# Altium project RSD_M1_HELMET_UNIT_PCB_V2.PrjPcb
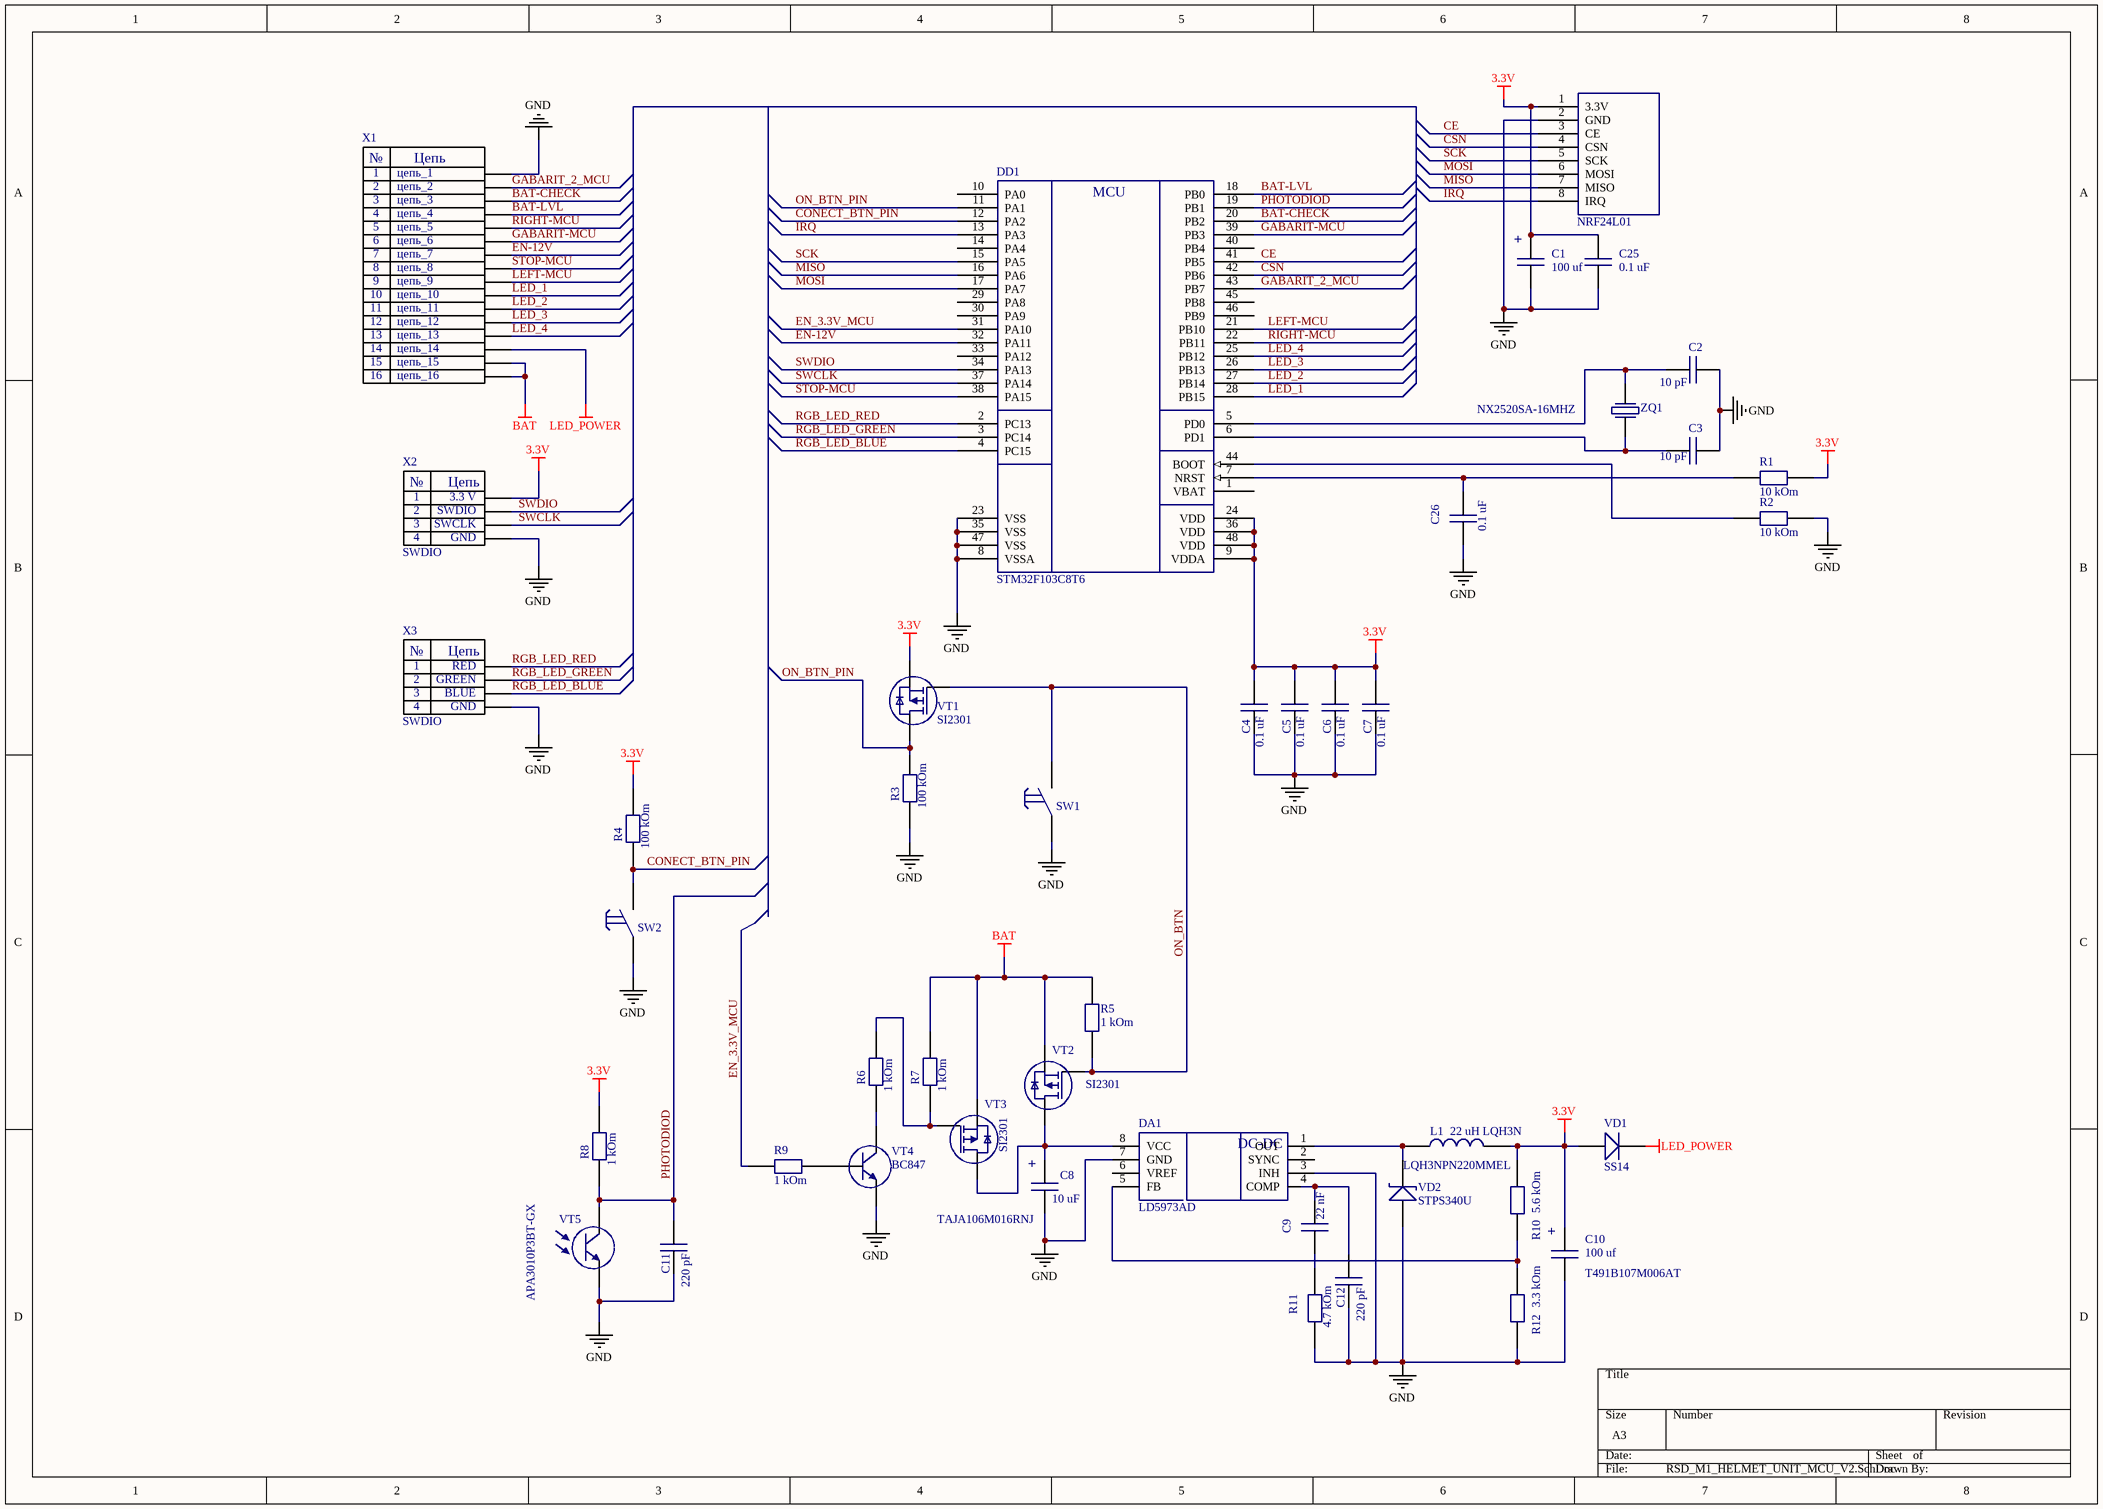
[diagram p0: RSD_M1_HELMET_UNIT_MCU_V2.SchDoc]
4 sheets, 193 parts. Net scope: flat (ports and power ports of the same name join across sheets).
Board files: RSD_M1_HELMET_UNIT_MCU_V2.PcbDoc, RSD_M1_HELMET_UNIT_POWER_V2.PcbDoc, RSD_M1_HELMET_MOTORCYCLE_UNITS_V2.PcbDoc
Sheets:
  RSD_M1_HELMET_UNIT_MCU_V2.SchDoc
  RSD_M1_HELMET_UNIT_POWER_V2.SchDoc
  RSD_M1_HELMET_UNIT_POWER_STOP_LIGHT_V2.SchDoc
  RSD_M1_HELMET_UNIT_MCU_STOP_LIGHT_V2.SchDoc

## Sheet RSD_M1_HELMET_UNIT_MCU_V2.SchDoc
size A3

### Parts
C1  100 uf  [tantal_case_B]
C2  value 10 pF  [CAP0603]  (hidden comment: Capacitor)
C3  value 10 pF  [CAP0603]  (hidden comment: Capacitor)
C4  value 0.1 uF  [CAP0603]  (hidden comment: Capacitor)
C5  value 0.1 uF  [CAP0603]  (hidden comment: Capacitor)
C6  value 0.1 uF  [CAP0603]  (hidden comment: Capacitor)
C7  value 0.1 uF  [CAP0603]  (hidden comment: Capacitor)
C8  10 uF  value TAJA106M016RNJ  [tantal_case_A]
C9  value 22 nF  [CAP0603]  (hidden comment: Capacitor)
C10  100 uf  value T491B107M006AT  [tantal_case_B]
C11  value 220 pF  [CAP0603]  (hidden comment: Capacitor)
C12  value 220 pF  [CAP0603]  (hidden comment: Capacitor)
C25  value 0.1 uF  [CAP0603]  (hidden comment: Capacitor)
C26  value 0.1 uF  [CAP0603]  (hidden comment: Capacitor)
DA1  LD5973AD  [SOIC-8]
DD1  value STM32F103C8T6  [STM32F103C8T6]  (hidden comment: STM32F103C8Tx)
L1  value 22 uH LQH3N  PN: LQH3NPN220MMEL  [LQH3N]  (hidden comment: coil)
NRF1  NRF24L01  [NRF24L01]
R1  value 10 kOm  [Res0603]  (hidden comment: Resistor)
R2  value 10 kOm  [Res0603]  (hidden comment: Resistor)
R3  value 100 kOm  [Res0603]  (hidden comment: Resistor)
R4  value 100 kOm  [Res0603]  (hidden comment: Resistor)
R5  value 1 kOm  [Res0603]  (hidden comment: Resistor)
R6  value 1 kOm  [Res0603]  (hidden comment: Resistor)
R7  value 1 kOm  [Res0603]  (hidden comment: Resistor)
R8  value 1 kOm  [Res0603]  (hidden comment: Resistor)
R9  value 1 kOm  [Res0603]  (hidden comment: Resistor)
R10  value 5.6 kOm  [Res0603]  (hidden comment: Resistor)
R11  value 4.7 kOm  [Res0603]  (hidden comment: Resistor)
R12  value 3.3 kOm  [Res0603]  (hidden comment: Resistor)
SW1  tact_switch  [tact_switch]  (value not drawn)
SW2  tact_switch  [tact_switch]  (value not drawn)
VD1  value SS14  [SMA-F]  (hidden comment: Diode)
VD2  value STPS340U  [SMB1]  (hidden comment: Schottky)
VT1  value SI2301  [SOT 23]  (hidden comment: MOSFET-P)
VT2  value SI2301  [SOT 23]  (hidden comment: MOSFET-P)
VT3  value SI2301  [SOT 23]  (hidden comment: MOSFET-P)
VT4  value BC847  [SOT 23]  (hidden comment: NPN)
VT5  value APA3010P3BT-GX  [LED0805]  (hidden comment: Phototransistor)
X1  16: цепь_16  1: цепь_1  2: цепь_2  3: цепь_3  4: цепь_4  5: цепь_5  6: цепь_6  7: цепь_7  8: цепь_8  9: цепь_9  10: цепь_10  11: цепь_11  12: цепь_12  13: цепь_13  14: цепь_14  15: цепь_15  [FPC_16_0.5]  (hidden comment: FPC_connector_16)
X2  SWDIO  1: 3.3 V  3: SWCLK  4: GND  [SWDIO]
X3  SWDIO  1: RED  2: GREEN  3: BLUE  4: GND  [SWDIO]
ZQ1  value NX2520SA-16MHZ  [crystal]  (hidden comment: Qartz)

### Nets
3.3V: C1.1 C4.2 C5.2 C6.2 C7.2 C10.1 C25.2 DD1.9(VDDA) DD1.24(VDD) DD1.36(VDD) DD1.48(VDD) L1.2 NRF1.1(3.3V) R1.2 R4.1 R8.2 R10.1 VD1.2 VT1.S X2.1
BAT: R5.2 R7.2 VT2.S VT3.S X1.15 X1.16
GND: C1.2 C2.1 C3.1 C4.1 C5.1 C6.1 C7.1 C8.2 C10.2 C11.1 C12.1 C25.1 C26.1 DA1.3(INH) DA1.7(GND) DD1.8(VSSA) DD1.23(VSS) DD1.35(VSS) DD1.47(VSS) NRF1.2(GND) R2.2 R3.2 R11.2 R12.2 SW1.1 SW2.1 VD2.2 VT4.E VT5.2 X1.1 X2.4 X3.4
LED_POWER: VD1.1 X1.14
BAT-CHECK: DD1.20(PB2) X1.3
BAT-LVL: DD1.18(PB0) X1.4
CE: DD1.41(PB5) NRF1.3(CE)
CONECT_BTN_PIN: DD1.12(PA2) R4.2 SW2.2
CSN: DD1.42(PB6) NRF1.4(CSN)
EN-12V: DD1.32(PA11) X1.7
EN_3.3V_MCU: DD1.31(PA10) R9.2
GABARIT-MCU: DD1.39(PB3) X1.6
GABARIT_2_MCU: DD1.43(PB7) X1.2
IRQ: DD1.13(PA3) NRF1.8(IRQ)
LED_1: DD1.28(PB15) X1.10
LED_2: DD1.27(PB14) X1.11
LED_3: DD1.26(PB13) X1.12
LED_4: DD1.25(PB12) X1.13
LEFT-MCU: DD1.21(PB10) X1.9
MISO: DD1.16(PA6) NRF1.7(MISO)
MOSI: DD1.17(PA7) NRF1.6(MOSI)
ON_BTN: R5.1 SW1.2 VT1.G VT2.G
ON_BTN_PIN: DD1.11(PA1) R3.1 VT1.D
PHOTODIOD: C11.2 DD1.19(PB1) R8.1 VT5.1
RGB_LED_BLUE: DD1.4(PC15) X3.3
RGB_LED_GREEN: DD1.3(PC14) X3.2
RGB_LED_RED: DD1.2(PC13) X3.1
RIGHT-MCU: DD1.22(PB11) X1.5
SCK: DD1.15(PA5) NRF1.5(SCK)
STOP-MCU: DD1.38(PA15) X1.8
SWCLK: DD1.37(PA14) X2.3
SWDIO: DD1.34(PA13) X2.2
NetC2_2: C2.2 DD1.5(PD0) ZQ1.2
NetC3_2: C3.2 DD1.6(PD1) ZQ1.1
NetC8_1: C8.1 DA1.8(VCC) VT2.D VT3.D
NetC9_1: C9.1 R11.1
NetC9_2: C9.2 C12.2 DA1.4(COMP)
NetC26_2: C26.2 DD1.7(NRST) R1.1
NetDA1_1: DA1.1(OUT) L1.1 VD2.1
NetDA1_5: DA1.5(FB) R10.2 R12.1
NetDD1_44: DD1.44(BOOT) R2.1
NetR6_1: R6.1 VT4.K
NetR6_2: R6.2 R7.1 VT3.G
NetR9_1: R9.1 VT4.B

Not connected (* = marked no-connect by the designer): DA1 2(SYNC) 6(VREF); DD1 1(VBAT) 10(PA0) 14(PA4) 29(PA8) 30(PA9) 33(PA12) 40(PB4) 45(PB8) 46(PB9)

### Notes on the sheet
- (in symbol Capacitor_Polar) +
- (in symbol FPC_connector_16) №; Цепь
- (in symbol LD5973AD) DC-DC
- (in symbol STM32F103C8Tx) MCU
- (in symbol SWDIO) №; Цепь

### Library data of the parts
C1 = Capacitor_Polar: Value: T491B107M006AT
C8 C10 = Capacitor_Polar
SW1 SW2 = tact_switch: Value: TL3330AF260QG
VT1-VT3 = MOSFET-P: pin to pad: D>3 G>1 S>2
VT4 = NPN: pin to pad: B>1 E>2 K>3
X1 = FPC_connector_16: Value: 0527461671
DA1 = LD5973AD: Value: LD5973AD
X2 X3 = SWDIO
  X2: 2: SWDIO

## Sheet RSD_M1_HELMET_UNIT_POWER_V2.SchDoc
size A2
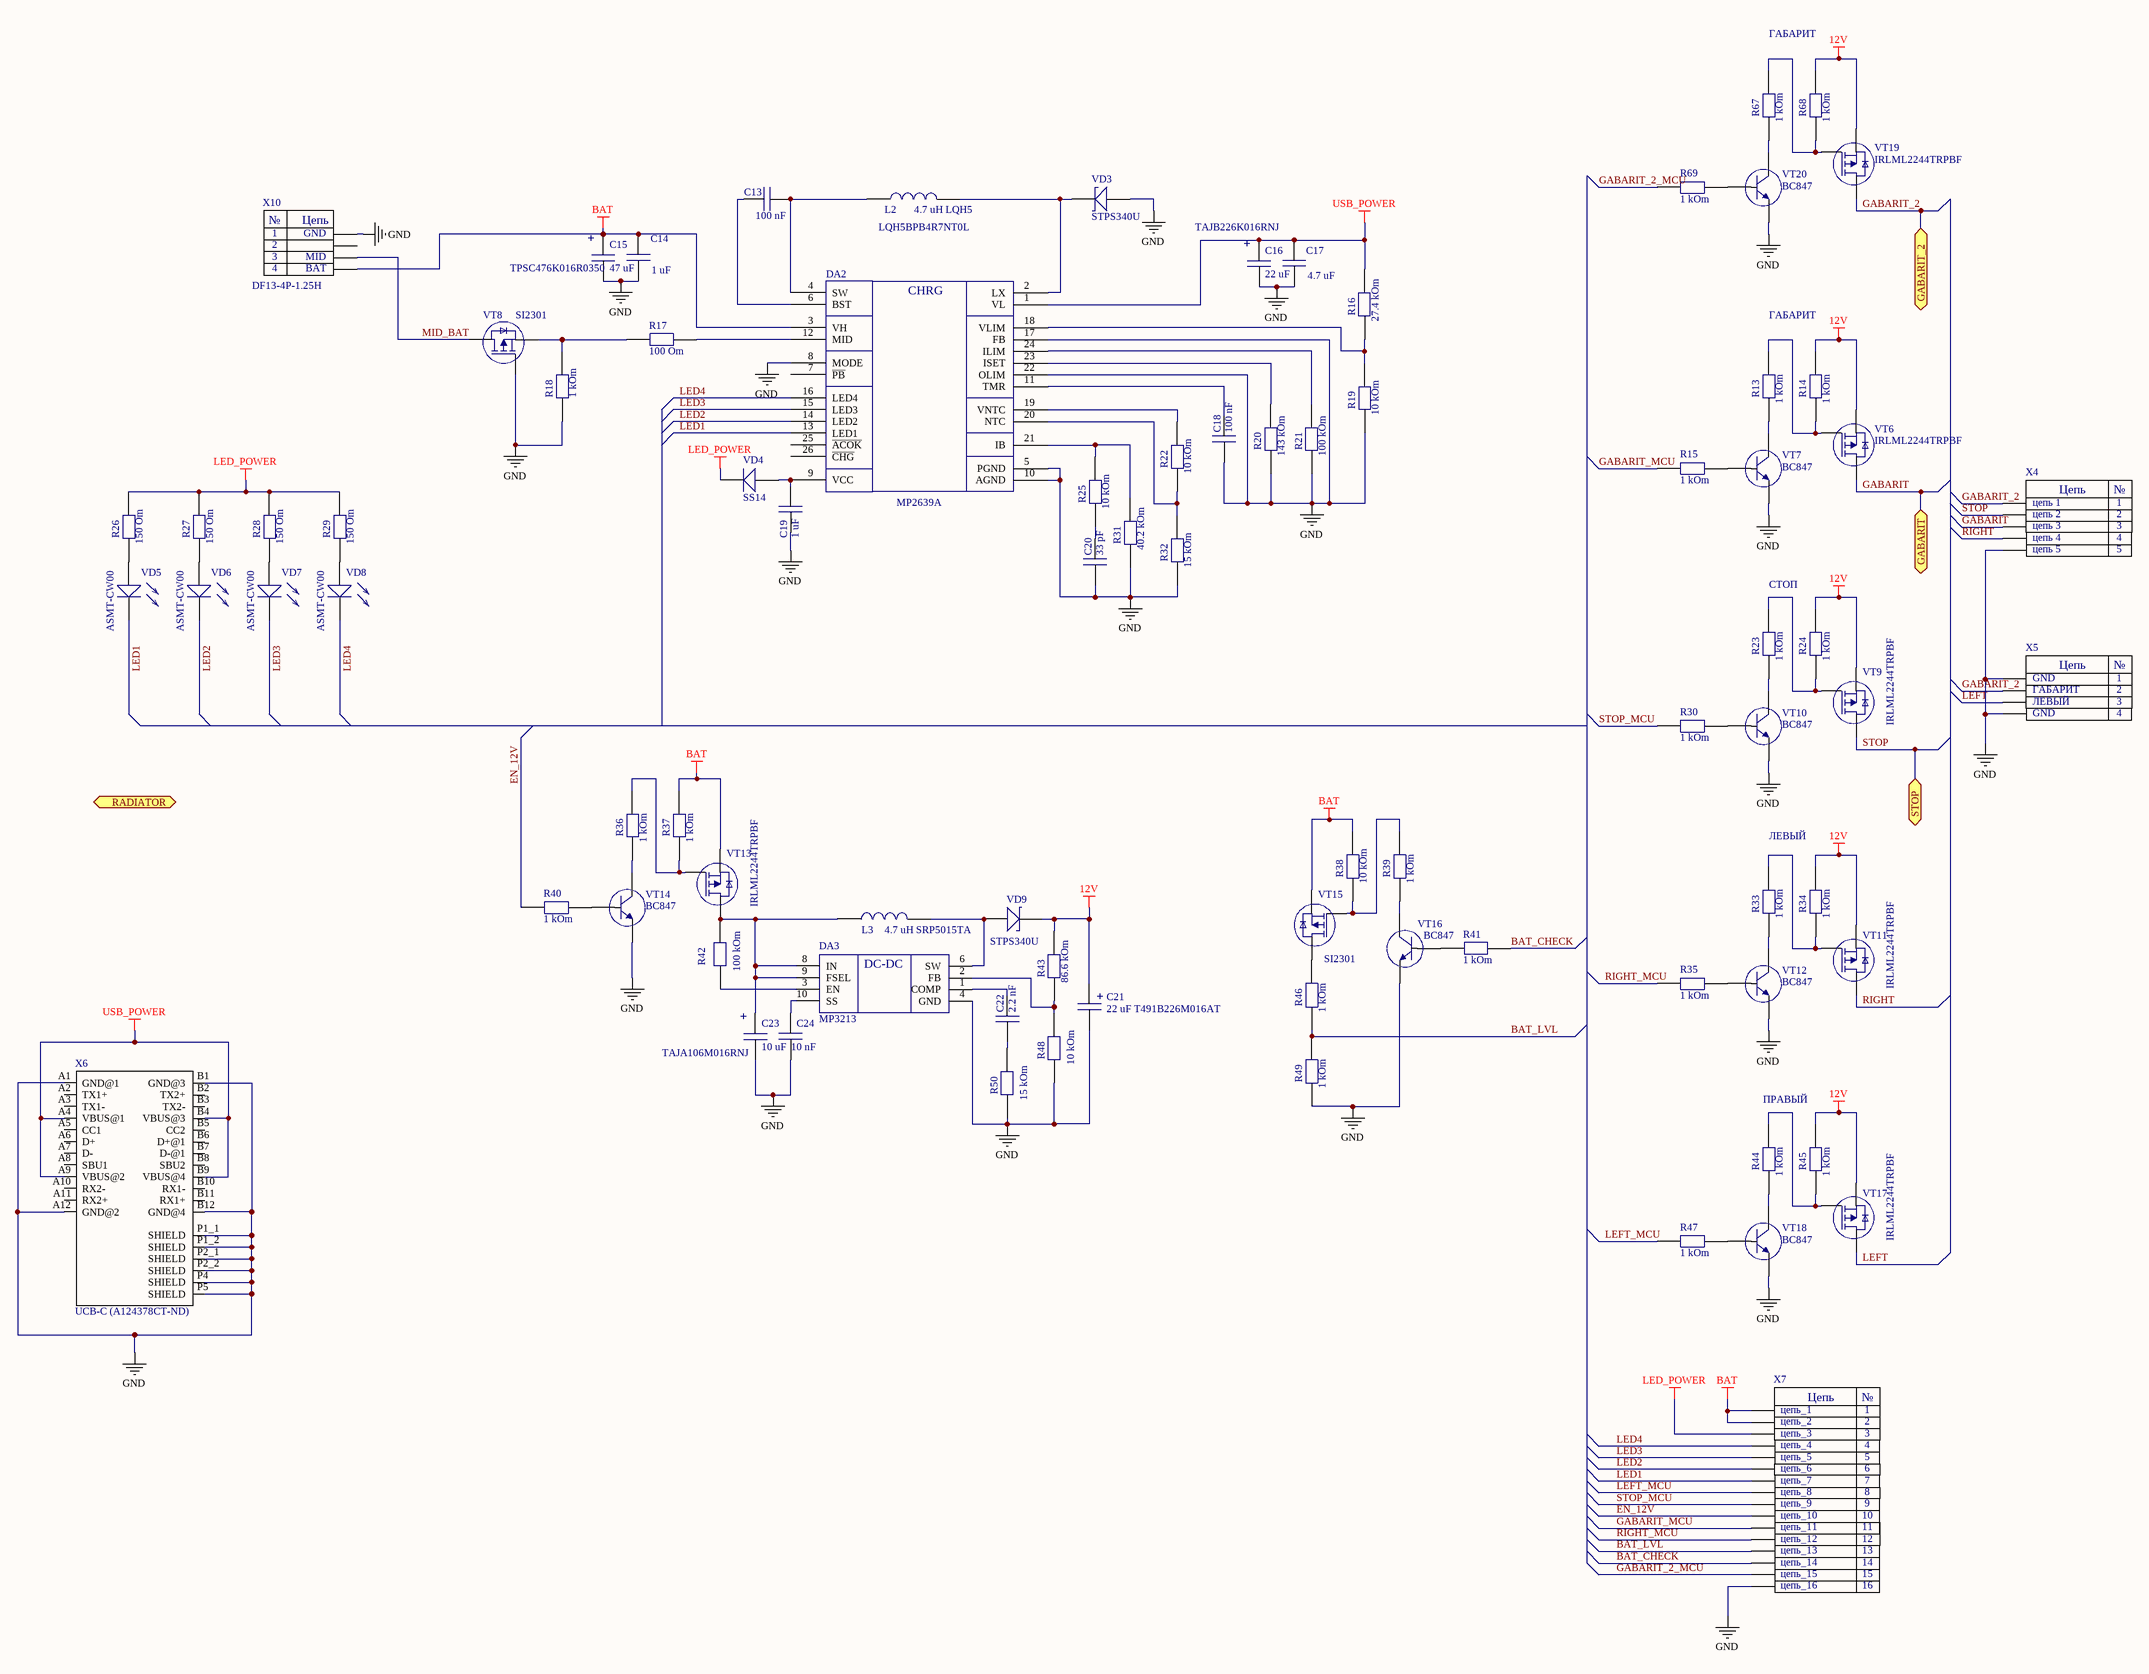
[diagram p1: RSD_M1_HELMET_UNIT_POWER_V2.SchDoc]

### Parts
C13  value 100 nF  [CAP0603]  (hidden comment: Capacitor)
C14  value 1 uF  [CAP0603]  (hidden comment: Capacitor)
C15  47 uF  value TPSC476K016R0350  [tantal_case_B]
C16  22 uF  value TAJB226K016RNJ  [tantal_case_B]
C17  value 4.7 uF  [CAP0603]  (hidden comment: Capacitor)
C18  value 100 nF  [CAP0603]  (hidden comment: Capacitor)
C19  value 1 uF  [CAP0603]  (hidden comment: Capacitor)
C20  value 33 pF  [CAP0603]  (hidden comment: Capacitor)
C21  value 22 uF T491B226M016AT  [tantal_case_B]  (hidden comment: Capacitor_Polar)
C22  value 2.2 nF  [CAP0603]  (hidden comment: Capacitor)
C23  10 uF  value TAJA106M016RNJ  [tantal_case_A]
C24  value 10 nF  [CAP0603]  (hidden comment: Capacitor)
DA2  value MP2639A  [MP2639]  (hidden comment: MP2639)
DA3  MP3213  [MP3213]
L2  value 4.7 uH LQH5  PN: LQH5BPB4R7NT0L  [LQH5BP]  (hidden comment: coil)
L3  value 4.7 uH SRP5015TA  [inductor_SRP5015TA]  (hidden comment: coil)
R13  value 1 kOm  [Res0603]  (hidden comment: Resistor)
R14  value 1 kOm  [Res0603]  (hidden comment: Resistor)
R15  value 1 kOm  [Res0603]  (hidden comment: Resistor)
R16  value 27.4 kOm  [Res0603]  (hidden comment: Resistor)
R17  value 100 Om  [Res0603]  (hidden comment: Resistor)
R18  value 1 kOm  [Res0603]  (hidden comment: Resistor)
R19  value 10 kOm  [Res0603]  (hidden comment: Resistor)
R20  value 143 kOm  [Res0603]  (hidden comment: Resistor)
R21  value 100 kOm  [Res0603]  (hidden comment: Resistor)
R22  value 10 kOm  [Res0603]  (hidden comment: Resistor)
R23  value 1 kOm  [Res0603]  (hidden comment: Resistor)
R24  value 1 kOm  [Res0603]  (hidden comment: Resistor)
R25  value 10 kOm  [Res0603]  (hidden comment: Resistor)
R26  value 150 Om  [Res0603]  (hidden comment: Resistor)
R27  value 150 Om  [Res0603]  (hidden comment: Resistor)
R28  value 150 Om  [Res0603]  (hidden comment: Resistor)
R29  value 150 Om  [Res0603]  (hidden comment: Resistor)
R30  value 1 kOm  [Res0603]  (hidden comment: Resistor)
R31  value 40.2 kOm  [Res0603]  (hidden comment: Resistor)
R32  value 15 kOm  [Res0603]  (hidden comment: Resistor)
R33  value 1 kOm  [Res0603]  (hidden comment: Resistor)
R34  value 1 kOm  [Res0603]  (hidden comment: Resistor)
R35  value 1 kOm  [Res0603]  (hidden comment: Resistor)
R36  value 1 kOm  [Res0603]  (hidden comment: Resistor)
R37  value 1 kOm  [Res0603]  (hidden comment: Resistor)
R38  value 10 kOm  [Res0603]  (hidden comment: Resistor)
R39  value 1 kOm  [Res0603]  (hidden comment: Resistor)
R40  value 1 kOm  [Res0603]  (hidden comment: Resistor)
R41  value 1 kOm  [Res0603]  (hidden comment: Resistor)
R42  value 100 kOm  [Res0603]  (hidden comment: Resistor)
R43  value 86.6 kOm  [Res0603]  (hidden comment: Resistor)
R44  value 1 kOm  [Res0603]  (hidden comment: Resistor)
R45  value 1 kOm  [Res0603]  (hidden comment: Resistor)
R46  value 1 kOm  [Res0603]  (hidden comment: Resistor)
R47  value 1 kOm  [Res0603]  (hidden comment: Resistor)
R48  value 10 kOm  [Res0603]  (hidden comment: Resistor)
R49  value 1 kOm  [Res0603]  (hidden comment: Resistor)
R50  value 15 kOm  [Res0603]  (hidden comment: Resistor)
R67  value 1 kOm  [Res0603]  (hidden comment: Resistor)
R68  value 1 kOm  [Res0603]  (hidden comment: Resistor)
R69  value 1 kOm  [Res0603]  (hidden comment: Resistor)
VD3  value STPS340U  [SMB1]  (hidden comment: Schottky)
VD4  value SS14  [SMA-F]  (hidden comment: Diode)
VD5  value ASMT-CW00  [LED 0603]  (hidden comment: LED)
VD6  value ASMT-CW00  [LED 0603]  (hidden comment: LED)
VD7  value ASMT-CW00  [LED 0603]  (hidden comment: LED)
VD8  value ASMT-CW00  [LED 0603]  (hidden comment: LED)
VD9  value STPS340U  [SMB1]  (hidden comment: Schottky)
VT6  value IRLML2244TRPBF  [SOT 23]  (hidden comment: MOSFET-P)
VT7  value BC847  [SOT 23]  (hidden comment: NPN)
VT8  value SI2301  [SOT 23]  (hidden comment: MOSFET-P)
VT9  value IRLML2244TRPBF  [SOT 23]  (hidden comment: MOSFET-P)
VT10  value BC847  [SOT 23]  (hidden comment: NPN)
VT11  value IRLML2244TRPBF  [SOT 23]  (hidden comment: MOSFET-P)
VT12  value BC847  [SOT 23]  (hidden comment: NPN)
VT13  value IRLML2244TRPBF  [SOT 23]  (hidden comment: MOSFET-P)
VT14  value BC847  [SOT 23]  (hidden comment: NPN)
VT15  value SI2301  [SOT 23]  (hidden comment: MOSFET-P)
VT16  value BC847  [SOT 23]  (hidden comment: NPN)
VT17  value IRLML2244TRPBF  [SOT 23]  (hidden comment: MOSFET-P)
VT18  value BC847  [SOT 23]  (hidden comment: NPN)
VT19  value IRLML2244TRPBF  [SOT 23]  (hidden comment: MOSFET-P)
VT20  value BC847  [SOT 23]  (hidden comment: NPN)
X4  1: цепь 1  2: цепь 2  3: цепь 3  4: цепь 4  5: цепь 5  [FPC_5_1]  (hidden comment: FPC_connector_5_1)
X5  1: GND  2: ГАБАРИТ  3: ЛЕВЫЙ  [FPC_4_1]  (hidden comment: FPC_connector_4_1)
X6  value UCB-C (A124378CT-ND)  [USB-C]  (hidden comment: UCB-C)
X7  16: цепь_16  1: цепь_1  2: цепь_2  3: цепь_3  4: цепь_4  5: цепь_5  6: цепь_6  7: цепь_7  8: цепь_8  9: цепь_9  10: цепь_10  11: цепь_11  12: цепь_12  13: цепь_13  14: цепь_14  15: цепь_15  [FPC_16_0.5]  (hidden comment: FPC_connector_16)
X10  value DF13-4P-1.25H  1: GND  3: MID  4: BAT  [bat_conn]  (hidden comment: BATTERY)

### Ports
GABARIT, GABARIT_2, RADIATOR, STOP

### Nets
12V: C21.1 R14.2 R24.2 R34.2 R43.1 R45.2 R68.2 VD9.1 VT6.S VT9.S VT11.S VT17.S VT19.S
BAT: C14.2 C15.1 DA2.3(VH) R37.2 R38.2 VT13.S VT15.S X7.1 X7.2 X10.4
GND: C14.1 C15.2 C16.2 C17.1 C18.1 C19.1 C20.1 C21.2 C23.2 C24.1 DA2.5(PGND) DA2.8(MODE) DA2.10(AGND) DA2.17(FB) DA2.22(OLIM) DA3.4(GND) R18.1 R19.1 R20.1 R21.2 R31.1 R32.1 R48.2 R49.1 R50.2 VD3.2 VT7.E VT8.G VT10.E VT12.E VT14.E VT16.E VT18.E VT20.E X4.5 X5.1 X5.4 X6.A1(GND@1) X6.A12(GND@2) X6.B1(GND@3) X6.B12(GND@4) X6.P1_1(SHIELD) X6.P1_2(SHIELD) X6.P2_1(SHIELD) X6.P2_2(SHIELD) X6.P4(SHIELD) X6.P5(SHIELD) X7.16 X10.1
LED_POWER: R26.2 R27.2 R28.2 R29.2 VD4.1 X7.3
USB_POWER: C16.1 C17.2 DA2.1(VL) R16.1 X6.A4(VBUS@1) X6.A9(VBUS@2) X6.B4(VBUS@3) X6.B9(VBUS@4)
BAT_CHECK: R41.2 X7.14
BAT_LVL: R46.1 R49.2 X7.13
EN_12V: R40.2 X7.10
GABARIT: VT6.D X4.3 ; port GABARIT
GABARIT_2: VT19.D X4.1 X5.2 ; port GABARIT_2
GABARIT_2_MCU: R69.2 X7.15
GABARIT_MCU: R15.2 X7.11
LED1: DA2.13(LED1) VD5.1 X7.7
LED2: DA2.14(LED2) VD6.1 X7.6
LED3: DA2.15(LED3) VD7.1 X7.5
LED4: DA2.16(LED4) VD8.1 X7.4
LEFT: VT17.D X5.3
LEFT_MCU: R47.2 X7.8
MID_BAT: VT8.D X10.3
RIGHT: VT11.D X4.4
RIGHT_MCU: R35.2 X7.12
STOP: VT9.D X4.2 ; port STOP
STOP_MCU: R30.2 X7.9
NetC13_1: C13.1 DA2.6(BST)
NetC13_2: C13.2 DA2.4(SW) L2.1
NetC18_2: C18.2 DA2.11(TMR)
NetC19_2: C19.2 DA2.9(VCC) VD4.2
NetC20_2: C20.2 R25.1
NetC22_1: C22.1 DA3.1(COMP)
NetC22_2: C22.2 R50.1
NetC23_1: C23.1 DA3.8(IN) DA3.9(FSEL) L3.1 R42.1 VT13.D
NetC24_2: C24.2 DA3.10(SS)
NetDA2_2: DA2.2(LX) L2.2 VD3.1
NetDA2_12: DA2.12(MID) R17.2
NetDA2_18: DA2.18(VLIM) R16.2 R19.2
NetDA2_19: DA2.19(VNTC) R22.2
NetDA2_20: DA2.20(NTC) R22.1 R32.2
NetDA2_21: DA2.21(IB) R25.2 R31.2
NetDA2_23: DA2.23(ISET) R20.2
NetDA2_24: DA2.24(ILIM) R21.1
NetDA3_2: DA3.2(FB) R43.2 R48.1
NetDA3_3: DA3.3(EN) R42.2
NetDA3_6: DA3.6(SW) L3.2 VD9.2
NetR13_1: R13.1 VT7.K
NetR13_2: R13.2 R14.1 VT6.G
NetR15_1: R15.1 VT7.B
NetR17_1: R17.1 R18.2 VT8.S
NetR23_1: R23.1 VT10.K
NetR23_2: R23.2 R24.1 VT9.G
NetR26_1: R26.1 VD5.2
NetR27_1: R27.1 VD6.2
NetR28_1: R28.1 VD7.2
NetR29_1: R29.1 VD8.2
NetR30_1: R30.1 VT10.B
NetR33_1: R33.1 VT12.K
NetR33_2: R33.2 R34.1 VT11.G
NetR35_1: R35.1 VT12.B
NetR36_1: R36.1 VT14.K
NetR36_2: R36.2 R37.1 VT13.G
NetR38_1: R38.1 R39.2 VT15.G
NetR39_1: R39.1 VT16.K
NetR40_1: R40.1 VT14.B
NetR41_1: R41.1 VT16.B
NetR44_1: R44.1 VT18.K
NetR44_2: R44.2 R45.1 VT17.G
NetR46_2: R46.2 VT15.D
NetR47_1: R47.1 VT18.B
NetR67_1: R67.1 VT20.K
NetR67_2: R67.2 R68.1 VT19.G
NetR69_1: R69.1 VT20.B

Not connected (* = marked no-connect by the designer): DA2 7(~{PB}) 25(~{ACOK}) 26(~{CHG}); X6 A2(TX1+) A3(TX1-) A5(CC1) A6(D+) A7(D-) A8(SBU1) A10(RX2-) A11(RX2+) B2(TX2+) B3(TX2-) B5(CC2) B6(D+@1) B7(D-@1) B8(SBU2) B10(RX1-) B11(RX1+); X10 2

### Notes on the sheet
- ГАБАРИТ
- СТОП
- ЛЕВЫЙ
- ПРАВЫЙ
- (in symbol Capacitor_Polar) +
- (in symbol FPC_connector_4_1) Цепь; №
- (in symbol FPC_connector_5_1) Цепь; №
- (in symbol FPC_connector_16) Цепь; №
- (in symbol MP2639) CHRG
- (in symbol MP3213) DC-DC
- (in symbol SWDIO) №; Цепь

### Library data of the parts
C15 C16 C23 = Capacitor_Polar
VT6 VT8 VT9 VT11 VT13 VT15 VT17 VT19 = MOSFET-P: pin to pad: D>3 G>1 S>2
VT7 VT10 VT12 VT14 VT16 VT18 VT20 = NPN: pin to pad: B>1 E>2 K>3
X4 = FPC_connector_5_1: Value: 0522070560
X5 = FPC_connector_4_1: Value: 0522070433; 4: GND
X7 = FPC_connector_16: Value: 0527461671
X10 = SWDIO
DA3 = MP3213: Value: MP3213

## Sheet RSD_M1_HELMET_UNIT_POWER_STOP_LIGHT_V2.SchDoc
size A4
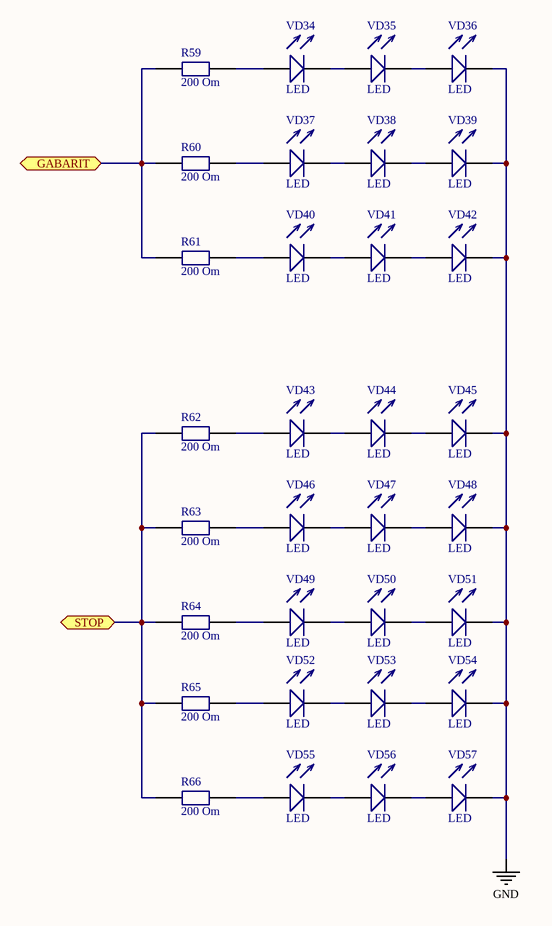
[diagram p2: RSD_M1_HELMET_UNIT_POWER_STOP_LIGHT_V2.SchDoc]

### Parts
R59  value 200 Om  [Res0603]  (hidden comment: Resistor)
R60  value 200 Om  [Res0603]  (hidden comment: Resistor)
R61  value 200 Om  [Res0603]  (hidden comment: Resistor)
R62  value 200 Om  [Res0603]  (hidden comment: Resistor)
R63  value 200 Om  [Res0603]  (hidden comment: Resistor)
R64  value 200 Om  [Res0603]  (hidden comment: Resistor)
R65  value 200 Om  [Res0603]  (hidden comment: Resistor)
R66  value 200 Om  [Res0603]  (hidden comment: Resistor)
VD34  LED  [3528_LED]
VD35  LED  [3528_LED]
VD36  LED  [3528_LED]
VD37  LED  [3528_LED]
VD38  LED  [3528_LED]
VD39  LED  [3528_LED]
VD40  LED  [3528_LED]
VD41  LED  [3528_LED]
VD42  LED  [3528_LED]
VD43  LED  [3528_LED]
VD44  LED  [3528_LED]
VD45  LED  [3528_LED]
VD46  LED  [3528_LED]
VD47  LED  [3528_LED]
VD48  LED  [3528_LED]
VD49  LED  [3528_LED]
VD50  LED  [3528_LED]
VD51  LED  [3528_LED]
VD52  LED  [3528_LED]
VD53  LED  [3528_LED]
VD54  LED  [3528_LED]
VD55  LED  [3528_LED]
VD56  LED  [3528_LED]
VD57  LED  [3528_LED]

### Ports
GABARIT, STOP

### Nets
GND: VD36.1 VD39.1 VD42.1 VD45.1 VD48.1 VD51.1 VD54.1 VD57.1
GABARIT: R59.2 R60.2 R61.2 ; port GABARIT
STOP: R62.2 R63.2 R64.2 R65.2 R66.2 ; port STOP
NetR59_1: R59.1 VD34.2
NetR60_1: R60.1 VD37.2
NetR61_1: R61.1 VD40.2
NetR62_1: R62.1 VD43.2
NetR63_1: R63.1 VD46.2
NetR64_1: R64.1 VD49.2
NetR65_1: R65.1 VD52.2
NetR66_1: R66.1 VD55.2
NetVD34_1: VD34.1 VD35.2
NetVD35_1: VD35.1 VD36.2
NetVD37_1: VD37.1 VD38.2
NetVD38_1: VD38.1 VD39.2
NetVD40_1: VD40.1 VD41.2
NetVD41_1: VD41.1 VD42.2
NetVD43_1: VD43.1 VD44.2
NetVD44_1: VD44.1 VD45.2
NetVD46_1: VD46.1 VD47.2
NetVD47_1: VD47.1 VD48.2
NetVD49_1: VD49.1 VD50.2
NetVD50_1: VD50.1 VD51.2
NetVD52_1: VD52.1 VD53.2
NetVD53_1: VD53.1 VD54.2
NetVD55_1: VD55.1 VD56.2
NetVD56_1: VD56.1 VD57.2

### Library data of the parts
VD34-VD57 = LED: Value: LED

## Sheet RSD_M1_HELMET_UNIT_MCU_STOP_LIGHT_V2.SchDoc
size A4
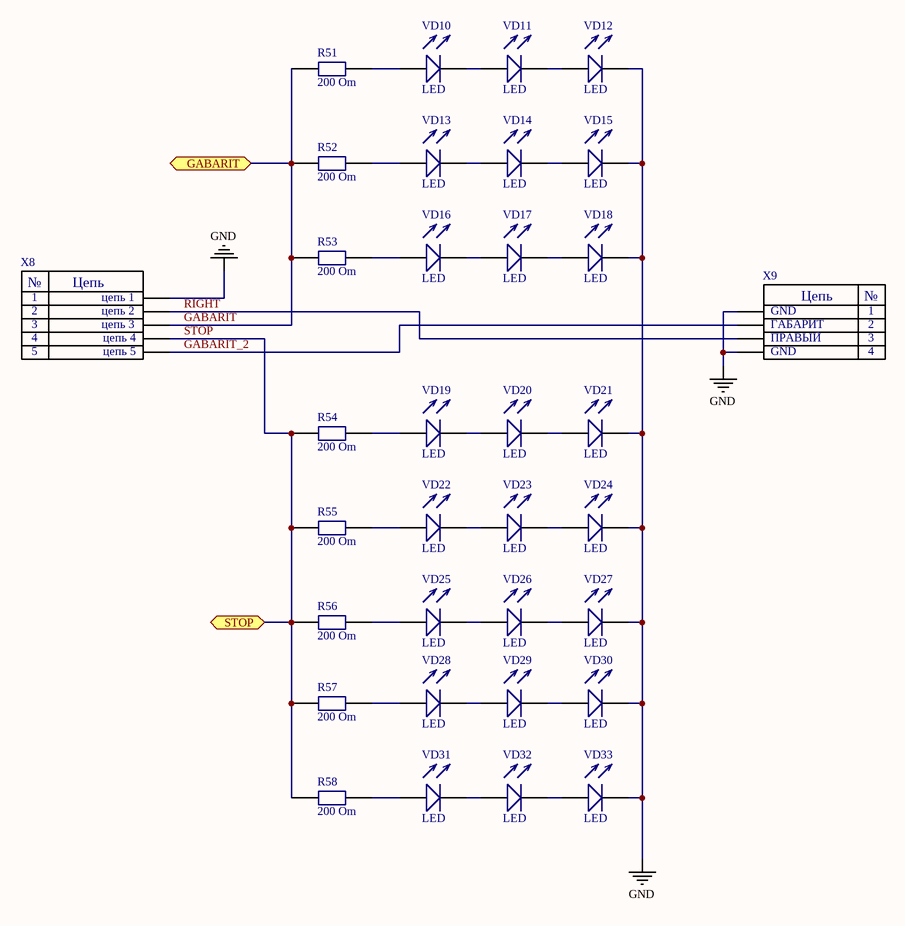
[diagram p3: RSD_M1_HELMET_UNIT_MCU_STOP_LIGHT_V2.SchDoc]

### Parts
R51  value 200 Om  [Res0603]  (hidden comment: Resistor)
R52  value 200 Om  [Res0603]  (hidden comment: Resistor)
R53  value 200 Om  [Res0603]  (hidden comment: Resistor)
R54  value 200 Om  [Res0603]  (hidden comment: Resistor)
R55  value 200 Om  [Res0603]  (hidden comment: Resistor)
R56  value 200 Om  [Res0603]  (hidden comment: Resistor)
R57  value 200 Om  [Res0603]  (hidden comment: Resistor)
R58  value 200 Om  [Res0603]  (hidden comment: Resistor)
VD10  LED  [3528_LED]
VD11  LED  [3528_LED]
VD12  LED  [3528_LED]
VD13  LED  [3528_LED]
VD14  LED  [3528_LED]
VD15  LED  [3528_LED]
VD16  LED  [3528_LED]
VD17  LED  [3528_LED]
VD18  LED  [3528_LED]
VD19  LED  [3528_LED]
VD20  LED  [3528_LED]
VD21  LED  [3528_LED]
VD22  LED  [3528_LED]
VD23  LED  [3528_LED]
VD24  LED  [3528_LED]
VD25  LED  [3528_LED]
VD26  LED  [3528_LED]
VD27  LED  [3528_LED]
VD28  LED  [3528_LED]
VD29  LED  [3528_LED]
VD30  LED  [3528_LED]
VD31  LED  [3528_LED]
VD32  LED  [3528_LED]
VD33  LED  [3528_LED]
X8  1: цепь 1  2: цепь 2  3: цепь 3  4: цепь 4  5: цепь 5  [FPC_5_1]  (hidden comment: FPC_connector_5_1)
X9  1: GND  2: ГАБАРИТ  3: ПРАВЫЙ  [FPC_4_1]  (hidden comment: FPC_connector_4_1)

### Ports
GABARIT, STOP

### Nets
GND: VD12.1 VD15.1 VD18.1 VD21.1 VD24.1 VD27.1 VD30.1 VD33.1 X8.1 X9.1 X9.4
GABARIT: R51.2 R52.2 R53.2 X8.3 ; port GABARIT
GABARIT_2: X8.5 X9.2
RIGHT: X8.2 X9.3
STOP: R54.2 R55.2 R56.2 R57.2 R58.2 X8.4 ; port STOP
NetR51_1: R51.1 VD10.2
NetR52_1: R52.1 VD13.2
NetR53_1: R53.1 VD16.2
NetR54_1: R54.1 VD19.2
NetR55_1: R55.1 VD22.2
NetR56_1: R56.1 VD25.2
NetR57_1: R57.1 VD28.2
NetR58_1: R58.1 VD31.2
NetVD10_1: VD10.1 VD11.2
NetVD11_1: VD11.1 VD12.2
NetVD13_1: VD13.1 VD14.2
NetVD14_1: VD14.1 VD15.2
NetVD16_1: VD16.1 VD17.2
NetVD17_1: VD17.1 VD18.2
NetVD19_1: VD19.1 VD20.2
NetVD20_1: VD20.1 VD21.2
NetVD22_1: VD22.1 VD23.2
NetVD23_1: VD23.1 VD24.2
NetVD25_1: VD25.1 VD26.2
NetVD26_1: VD26.1 VD27.2
NetVD28_1: VD28.1 VD29.2
NetVD29_1: VD29.1 VD30.2
NetVD31_1: VD31.1 VD32.2
NetVD32_1: VD32.1 VD33.2

### Notes on the sheet
- (in symbol FPC_connector_4_1) Цепь; №
- (in symbol FPC_connector_5_1) №; Цепь

### Library data of the parts
X9 = FPC_connector_4_1: Value: 0522070433; 4: GND
VD10-VD33 = LED: Value: LED

## Nets that join several sheets
BAT: RSD_M1_HELMET_UNIT_MCU_V2 (6 pins), RSD_M1_HELMET_UNIT_POWER_V2 (10 pins)
GND: RSD_M1_HELMET_UNIT_MCU_V2 (32 pins), RSD_M1_HELMET_UNIT_POWER_V2 (49 pins), RSD_M1_HELMET_UNIT_POWER_STOP_LIGHT_V2 (8 pins), RSD_M1_HELMET_UNIT_MCU_STOP_LIGHT_V2 (11 pins)
LED_POWER: RSD_M1_HELMET_UNIT_MCU_V2 (VD1.1 X1.14), RSD_M1_HELMET_UNIT_POWER_V2 (6 pins)
GABARIT: RSD_M1_HELMET_UNIT_POWER_V2 (VT6.D X4.3), RSD_M1_HELMET_UNIT_POWER_STOP_LIGHT_V2 (R59.2 R60.2 R61.2), RSD_M1_HELMET_UNIT_MCU_STOP_LIGHT_V2 (R51.2 R52.2 R53.2 X8.3)
STOP: RSD_M1_HELMET_UNIT_POWER_V2 (VT9.D X4.2), RSD_M1_HELMET_UNIT_POWER_STOP_LIGHT_V2 (5 pins), RSD_M1_HELMET_UNIT_MCU_STOP_LIGHT_V2 (6 pins)